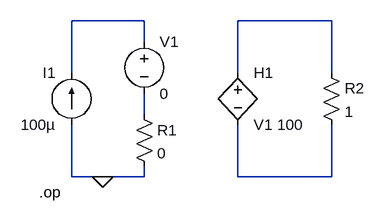
[diagram p0: schematic currentDependentVoltageSource.asc]
currentDependentVoltageSource.asc, the LTspice schematic file:
Version 4
SHEET 1 880 680
WIRE 64 32 -48 32
WIRE 352 32 208 32
WIRE 64 64 64 32
WIRE -48 112 -48 32
WIRE 208 112 208 32
WIRE 352 112 352 32
WIRE 64 176 64 144
WIRE -48 272 -48 192
WIRE 0 272 -48 272
WIRE 64 272 64 256
WIRE 64 272 0 272
WIRE 208 272 208 192
WIRE 352 272 352 192
WIRE 352 272 208 272
FLAG 0 272 0
DATAFLAG 208 32 ""
SYMBOL h 208 96 R0
SYMATTR InstName H1
SYMATTR Value V1 100
SYMBOL voltage 64 48 R0
SYMATTR InstName V1
SYMATTR Value 0
SYMBOL res 48 160 R0
SYMATTR InstName R1
SYMATTR Value 0
SYMBOL current -48 192 R180
WINDOW 0 24 80 Left 2
WINDOW 3 24 0 Left 2
SYMATTR InstName I1
SYMATTR Value 100µ
SYMBOL res 336 96 R0
SYMATTR InstName R2
SYMATTR Value 1
TEXT -98 296 Left 2 !.op

The netlist it stands for:
* currentDependentVoltageSource.asc
H1 N002 N004 V1 100
V1 N001 N003 0
R1 N003 0 0
I1 0 N001 100µ
R2 N002 N004 1
.op
.backanno
.end